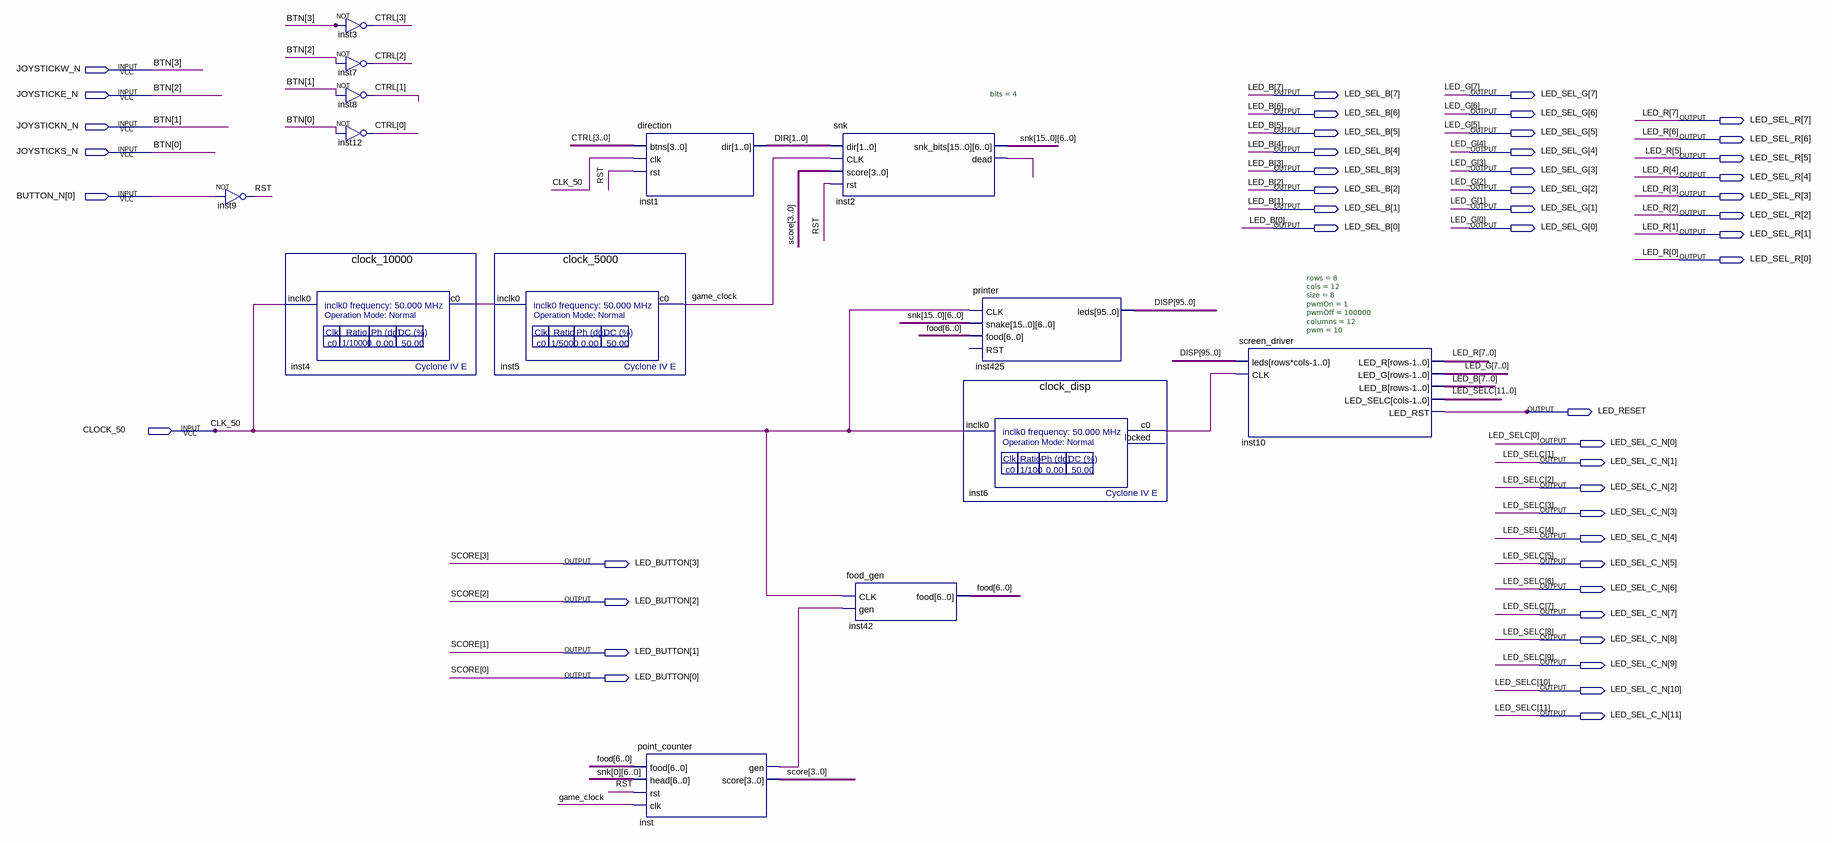
[diagram p0: schematic sheet]
// Quartus schematic snake.bdf as structural Verilog: 14 symbols, 47 pins
module snake (
  input  JOYSTICKW_N,
  input  JOYSTICKE_N,
  input  JOYSTICKN_N,
  input  JOYSTICKS_N,
  input  [0:0] BUTTON_N,
  input  CLOCK_50,
  output [7:0] LED_SEL_B,
  output [7:0] LED_SEL_G,
  output [7:0] LED_SEL_R,
  output LED_RESET,
  output [11:0] LED_SEL_C_N,
  output [3:0] LED_BUTTON
);

  wire game_clock, inst2_dead, inst4_c0, inst6_c0, inst_gen, RST;
  wire [1:0] DIR;
  wire [3:0] CTRL;
  wire [6:0] food, snk_0, snk_1, snk_2, snk_3, snk_4, snk_5, snk_6, snk_7, snk_8, snk_9, snk_10, snk_11,
       snk_12, snk_13, snk_14, snk_15;
  wire [95:0] DISP;

  not inst9 (RST, BUTTON_N[0]);
  clock_10000 inst4 (.inclk0(CLOCK_50), .c0(inst4_c0));
  not inst3 (CTRL[3], JOYSTICKW_N);
  not inst7 (CTRL[2], JOYSTICKE_N);
  not inst8 (CTRL[1], JOYSTICKN_N);
  not inst12 (CTRL[0], JOYSTICKS_N);
  clock_5000 inst5 (.inclk0(inst4_c0), .c0(game_clock));
  direction inst1 (.btns(CTRL), .clk(CLOCK_50), .rst(RST), .dir(DIR));
  point_counter inst (.food(food), .head(snk_0), .rst(RST), .clk(game_clock), .gen(inst_gen), .score(LED_BUTTON));
  snk #(.bits(4)) inst2 (
    .dir(DIR), .CLK(game_clock), .score(LED_BUTTON), .rst(RST),
    .snk_bits({snk_15, snk_14, snk_13, snk_12, snk_11, snk_10, snk_9, snk_8, snk_7, snk_6, snk_5, snk_4, snk_3, snk_2, snk_1, snk_0}),
    .dead(inst2_dead));
  food_gen inst42 (.CLK(CLOCK_50), .gen(inst_gen), .food(food));
  printer inst425 (
    .CLK(CLOCK_50),
    .snake({snk_15, snk_14, snk_13, snk_12, snk_11, snk_10, snk_9, snk_8, snk_7, snk_6, snk_5, snk_4, snk_3, snk_2, snk_1, snk_0}),
    .food(food), .leds(DISP));  // open: RST
  clock_disp inst6 (.inclk0(CLOCK_50), .c0(inst6_c0));  // open: locked
  screen_driver #(.rows(8), .cols(12), .size(8), .pwmOn(1), .pwmOff(100000), .columns(12), .pwm(10)) inst10 (
    .leds(DISP), .CLK(inst6_c0), .LED_R(LED_SEL_R), .LED_G(LED_SEL_G), .LED_B(LED_SEL_B),
    .LED_SELC(LED_SEL_C_N), .LED_RST(LED_RESET));

  // Other names for the same wires on the sheet: BTN[3:0] = {JOYSTICKW_N, JOYSTICKE_N, JOYSTICKN_N, JOYSTICKS_N};
  //   CLK_50 = CLOCK_50; LED_B[7:0] = LED_SEL_B; LED_G[7:0] = LED_SEL_G; LED_R[7:0] = LED_SEL_R;
  //   LED_SELC[11:0] = LED_SEL_C_N; SCORE[3:0] = LED_BUTTON
endmodule
